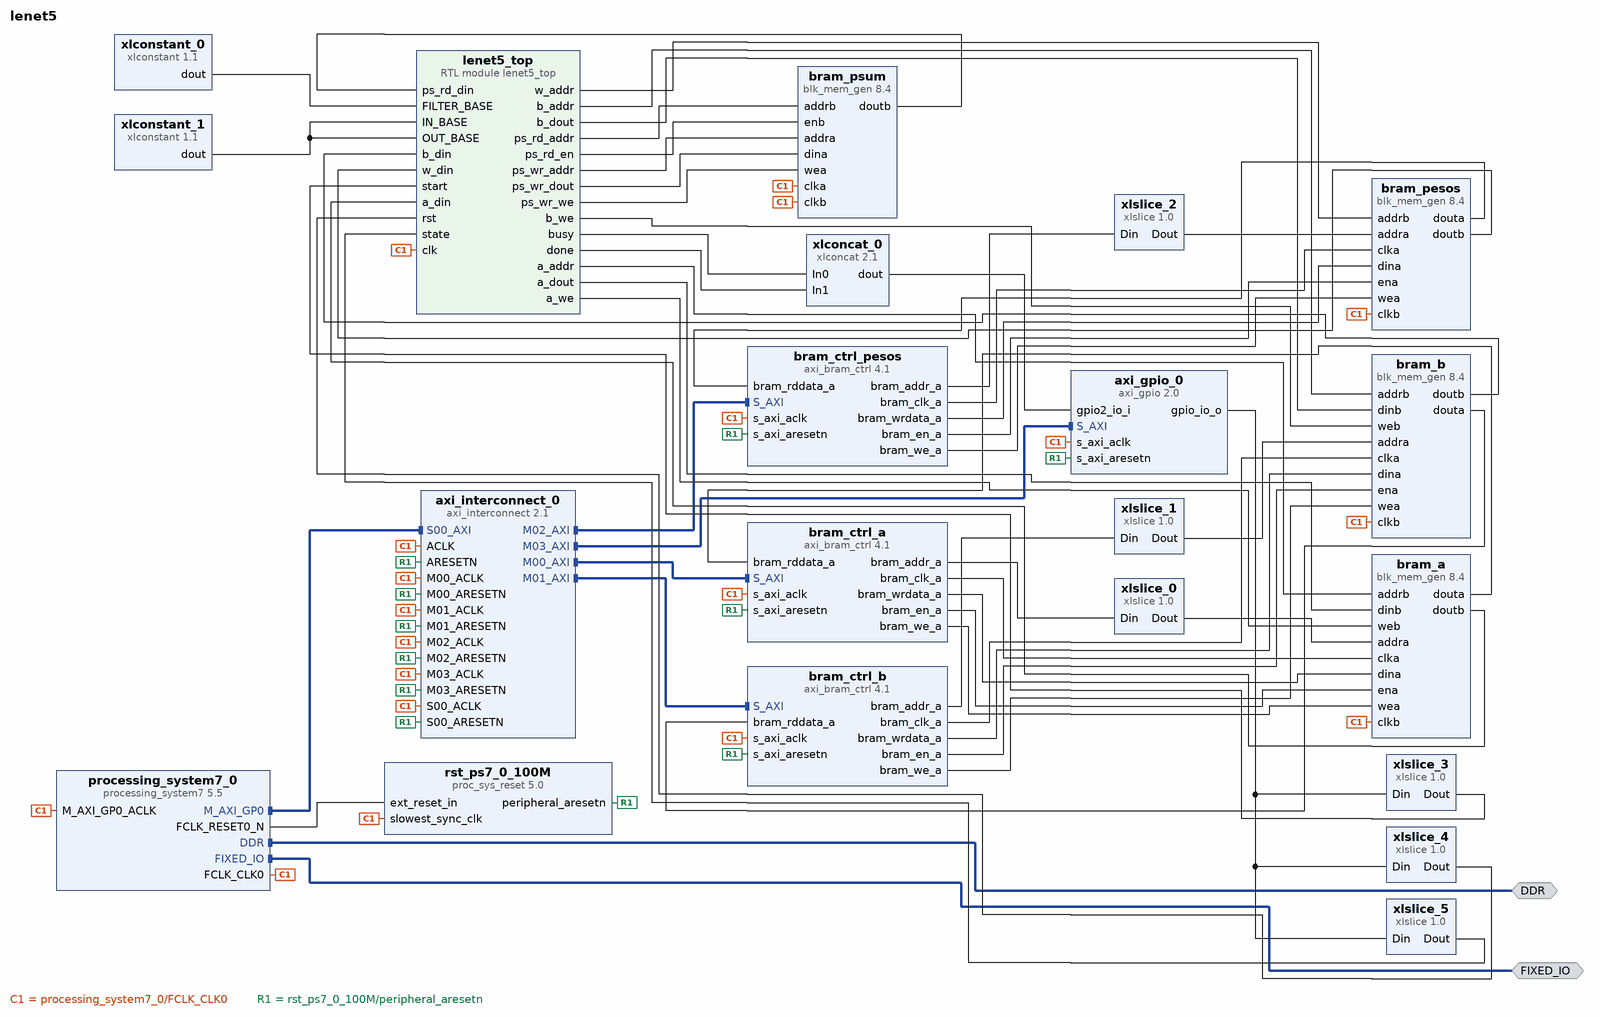
[diagram p0: block diagram of the top level]
# Vivado block design lenet5, xc7z010clg400-2, Vivado 2019.1
create_bd_design lenet5

create_bd_intf_port -mode Master -vlnv xilinx.com:interface:ddrx_rtl:1.0 DDR
create_bd_intf_port -mode Master -vlnv xilinx.com:display_processing_system7:fixedio_rtl:1.0 FIXED_IO

create_bd_cell -type ip -vlnv xilinx.com:ip:processing_system7:5.5 processing_system7_0
set_property -dict [list \
  CONFIG.PCW_FPGA0_PERIPHERAL_FREQMHZ 100 \
  CONFIG.PCW_UART0_PERIPHERAL_ENABLE 1 \
  CONFIG.PCW_UART0_UART0_IO {MIO 10 .. 11} \
  CONFIG.PCW_UART_PERIPHERAL_FREQMHZ 100 \
] [get_bd_cells processing_system7_0]
# 41 more settings of processing_system7_0 are not shown: defaults, MIO pin electricals, DDR timing, and values the tool derives
create_bd_cell -type ip -vlnv xilinx.com:ip:blk_mem_gen:8.4 bram_a
set_property -dict [list \
  CONFIG.Byte_Size 8 \
  CONFIG.Enable_32bit_Address false \
  CONFIG.Enable_B Always_Enabled \
  CONFIG.Memory_Type True_Dual_Port_RAM \
  CONFIG.Port_B_Clock 100 \
  CONFIG.Port_B_Enable_Rate 100 \
  CONFIG.Port_B_Write_Rate 50 \
  CONFIG.Read_Width_A 128 \
  CONFIG.Read_Width_B 128 \
  CONFIG.Register_PortA_Output_of_Memory_Primitives true \
  CONFIG.Register_PortB_Output_of_Memory_Primitives true \
  CONFIG.Use_Byte_Write_Enable true \
  CONFIG.Use_RSTA_Pin false \
  CONFIG.Write_Depth_A 512 \
  CONFIG.Write_Width_A 128 \
  CONFIG.Write_Width_B 128 \
  CONFIG.use_bram_block Stand_Alone \
] [get_bd_cells bram_a]
create_bd_cell -type ip -vlnv xilinx.com:ip:blk_mem_gen:8.4 bram_b
set_property -dict [list \
  CONFIG.Byte_Size 8 \
  CONFIG.Enable_32bit_Address false \
  CONFIG.Enable_B Always_Enabled \
  CONFIG.Memory_Type True_Dual_Port_RAM \
  CONFIG.Port_B_Clock 100 \
  CONFIG.Port_B_Enable_Rate 100 \
  CONFIG.Port_B_Write_Rate 50 \
  CONFIG.Read_Width_A 128 \
  CONFIG.Read_Width_B 128 \
  CONFIG.Register_PortA_Output_of_Memory_Primitives true \
  CONFIG.Register_PortB_Output_of_Memory_Primitives true \
  CONFIG.Use_Byte_Write_Enable true \
  CONFIG.Use_RSTA_Pin false \
  CONFIG.Use_RSTB_Pin false \
  CONFIG.Write_Depth_A 512 \
  CONFIG.Write_Width_A 128 \
  CONFIG.Write_Width_B 128 \
  CONFIG.use_bram_block Stand_Alone \
] [get_bd_cells bram_b]
create_bd_cell -type ip -vlnv xilinx.com:ip:blk_mem_gen:8.4 bram_pesos
set_property -dict [list \
  CONFIG.Byte_Size 8 \
  CONFIG.Enable_32bit_Address false \
  CONFIG.Enable_B Always_Enabled \
  CONFIG.Memory_Type True_Dual_Port_RAM \
  CONFIG.Port_B_Clock 100 \
  CONFIG.Port_B_Enable_Rate 100 \
  CONFIG.Port_B_Write_Rate 50 \
  CONFIG.Read_Width_A 128 \
  CONFIG.Read_Width_B 128 \
  CONFIG.Register_PortA_Output_of_Memory_Primitives true \
  CONFIG.Register_PortB_Output_of_Memory_Primitives true \
  CONFIG.Use_Byte_Write_Enable true \
  CONFIG.Use_RSTA_Pin false \
  CONFIG.Write_Depth_A 8192 \
  CONFIG.Write_Width_A 128 \
  CONFIG.Write_Width_B 128 \
  CONFIG.use_bram_block Stand_Alone \
] [get_bd_cells bram_pesos]
create_bd_cell -type ip -vlnv xilinx.com:ip:blk_mem_gen:8.4 bram_psum
set_property -dict [list \
  CONFIG.Byte_Size 8 \
  CONFIG.Enable_32bit_Address false \
  CONFIG.Enable_A Always_Enabled \
  CONFIG.Enable_B Use_ENB_Pin \
  CONFIG.Memory_Type Simple_Dual_Port_RAM \
  CONFIG.Operating_Mode_A WRITE_FIRST \
  CONFIG.Port_B_Clock 100 \
  CONFIG.Port_B_Enable_Rate 100 \
  CONFIG.Read_Width_B 32 \
  CONFIG.Register_PortB_Output_of_Memory_Primitives true \
  CONFIG.Use_Byte_Write_Enable true \
  CONFIG.Write_Depth_A 2048 \
  CONFIG.Write_Width_A 32 \
  CONFIG.Write_Width_B 32 \
  CONFIG.use_bram_block Stand_Alone \
] [get_bd_cells bram_psum]
create_bd_cell -type ip -vlnv xilinx.com:ip:axi_bram_ctrl:4.1 bram_ctrl_a
set_property -dict {CONFIG.DATA_WIDTH 128 CONFIG.SINGLE_PORT_BRAM 1} [get_bd_cells bram_ctrl_a]
create_bd_cell -type ip -vlnv xilinx.com:ip:axi_bram_ctrl:4.1 bram_ctrl_b
set_property -dict {CONFIG.DATA_WIDTH 128 CONFIG.SINGLE_PORT_BRAM 1} [get_bd_cells bram_ctrl_b]
create_bd_cell -type ip -vlnv xilinx.com:ip:axi_bram_ctrl:4.1 bram_ctrl_pesos
set_property -dict {CONFIG.DATA_WIDTH 128 CONFIG.SINGLE_PORT_BRAM 1} [get_bd_cells bram_ctrl_pesos]
create_bd_cell -type ip -vlnv xilinx.com:ip:axi_gpio:2.0 axi_gpio_0
set_property -dict [list \
  CONFIG.C_ALL_INPUTS_2 1 \
  CONFIG.C_ALL_OUTPUTS 1 \
  CONFIG.C_GPIO2_WIDTH 2 \
  CONFIG.C_GPIO_WIDTH 5 \
  CONFIG.C_IS_DUAL 1 \
] [get_bd_cells axi_gpio_0]
create_bd_cell -type ip -vlnv xilinx.com:ip:xlslice:1.0 xlslice_0
set_property -dict {CONFIG.DIN_FROM 12 CONFIG.DIN_TO 4 CONFIG.DIN_WIDTH 13 CONFIG.DOUT_WIDTH 9} [get_bd_cells xlslice_0]
create_bd_cell -type ip -vlnv xilinx.com:ip:xlslice:1.0 xlslice_1
set_property -dict {CONFIG.DIN_FROM 12 CONFIG.DIN_TO 4 CONFIG.DIN_WIDTH 13 CONFIG.DOUT_WIDTH 9} [get_bd_cells xlslice_1]
create_bd_cell -type ip -vlnv xilinx.com:ip:xlconcat:2.1 xlconcat_0
create_bd_cell -type ip -vlnv xilinx.com:ip:xlslice:1.0 xlslice_3
set_property -dict {CONFIG.DIN_FROM 0 CONFIG.DIN_TO 0 CONFIG.DIN_WIDTH 5} [get_bd_cells xlslice_3]
create_bd_cell -type ip -vlnv xilinx.com:ip:xlslice:1.0 xlslice_4
set_property -dict {CONFIG.DIN_FROM 1 CONFIG.DIN_TO 1 CONFIG.DIN_WIDTH 5 CONFIG.DOUT_WIDTH 1} [get_bd_cells xlslice_4]
create_bd_cell -type ip -vlnv xilinx.com:ip:proc_sys_reset:5.0 rst_ps7_0_100M
create_bd_cell -type ip -vlnv xilinx.com:ip:axi_interconnect:2.1 axi_interconnect_0
set_property -dict {CONFIG.NUM_MI 4 CONFIG.STRATEGY 1} [get_bd_cells axi_interconnect_0]
create_bd_cell -type ip -vlnv xilinx.com:ip:xlconstant:1.1 xlconstant_1
set_property -dict {CONFIG.CONST_VAL 0 CONFIG.CONST_WIDTH 9} [get_bd_cells xlconstant_1]
create_bd_cell -type ip -vlnv xilinx.com:ip:xlslice:1.0 xlslice_5
set_property -dict {CONFIG.DIN_FROM 4 CONFIG.DIN_TO 2 CONFIG.DIN_WIDTH 5 CONFIG.DOUT_WIDTH 1} [get_bd_cells xlslice_5]
create_bd_cell -type ip -vlnv xilinx.com:ip:xlconstant:1.1 xlconstant_0
set_property -dict {CONFIG.CONST_VAL 0 CONFIG.CONST_WIDTH 13} [get_bd_cells xlconstant_0]
create_bd_cell -type ip -vlnv xilinx.com:ip:xlslice:1.0 xlslice_2
set_property -dict {CONFIG.DIN_FROM 16 CONFIG.DIN_TO 4 CONFIG.DIN_WIDTH 17 CONFIG.DOUT_WIDTH 12} [get_bd_cells xlslice_2]
create_bd_cell -type module -reference lenet5_top lenet5_top

# ---- connections ----

connect_bd_intf_net [get_bd_intf_ports DDR] [get_bd_intf_pins processing_system7_0/DDR]
connect_bd_intf_net [get_bd_intf_pins axi_interconnect_0/M03_AXI] [get_bd_intf_pins axi_gpio_0/S_AXI]
connect_bd_intf_net [get_bd_intf_pins processing_system7_0/M_AXI_GP0] [get_bd_intf_pins axi_interconnect_0/S00_AXI]
connect_bd_intf_net [get_bd_intf_pins axi_interconnect_0/M02_AXI] [get_bd_intf_pins bram_ctrl_pesos/S_AXI]
connect_bd_intf_net [get_bd_intf_ports FIXED_IO] [get_bd_intf_pins processing_system7_0/FIXED_IO]
connect_bd_intf_net [get_bd_intf_pins axi_interconnect_0/M01_AXI] [get_bd_intf_pins bram_ctrl_b/S_AXI]
connect_bd_intf_net [get_bd_intf_pins axi_interconnect_0/M00_AXI] [get_bd_intf_pins bram_ctrl_a/S_AXI]
connect_bd_net [get_bd_pins bram_ctrl_a/bram_clk_a] [get_bd_pins bram_a/clka]
connect_bd_net [get_bd_pins bram_ctrl_a/bram_wrdata_a] [get_bd_pins bram_a/dina]
connect_bd_net [get_bd_pins bram_a/douta] [get_bd_pins bram_ctrl_a/bram_rddata_a]
connect_bd_net [get_bd_pins bram_ctrl_a/bram_en_a] [get_bd_pins bram_a/ena]
connect_bd_net [get_bd_pins bram_ctrl_a/bram_we_a] [get_bd_pins bram_a/wea]
connect_bd_net [get_bd_pins bram_ctrl_b/bram_clk_a] [get_bd_pins bram_b/clka]
connect_bd_net [get_bd_pins bram_ctrl_b/bram_wrdata_a] [get_bd_pins bram_b/dina]
connect_bd_net [get_bd_pins bram_b/douta] [get_bd_pins bram_ctrl_b/bram_rddata_a]
connect_bd_net [get_bd_pins bram_ctrl_b/bram_en_a] [get_bd_pins bram_b/ena]
connect_bd_net [get_bd_pins bram_ctrl_b/bram_we_a] [get_bd_pins bram_b/wea]
connect_bd_net [get_bd_pins bram_ctrl_pesos/bram_clk_a] [get_bd_pins bram_pesos/clka]
connect_bd_net [get_bd_pins bram_ctrl_pesos/bram_wrdata_a] [get_bd_pins bram_pesos/dina]
connect_bd_net [get_bd_pins bram_pesos/douta] [get_bd_pins bram_ctrl_pesos/bram_rddata_a]
connect_bd_net [get_bd_pins bram_ctrl_pesos/bram_en_a] [get_bd_pins bram_pesos/ena]
connect_bd_net [get_bd_pins bram_ctrl_pesos/bram_we_a] [get_bd_pins bram_pesos/wea]
connect_bd_net [get_bd_pins bram_ctrl_a/bram_addr_a] [get_bd_pins xlslice_0/Din]
connect_bd_net [get_bd_pins xlslice_0/Dout] [get_bd_pins bram_a/addra]
connect_bd_net [get_bd_pins bram_ctrl_b/bram_addr_a] [get_bd_pins xlslice_1/Din]
connect_bd_net [get_bd_pins xlslice_1/Dout] [get_bd_pins bram_b/addra]
connect_bd_net [get_bd_pins lenet5_top/ps_rd_addr] [get_bd_pins bram_psum/addrb]
connect_bd_net [get_bd_pins bram_psum/doutb] [get_bd_pins lenet5_top/ps_rd_din]
connect_bd_net [get_bd_pins lenet5_top/ps_rd_en] [get_bd_pins bram_psum/enb]
connect_bd_net [get_bd_pins lenet5_top/ps_wr_addr] [get_bd_pins bram_psum/addra]
connect_bd_net -net lenet5_top_ps_wr_din [get_bd_pins lenet5_top/ps_wr_dout] [get_bd_pins bram_psum/dina]
connect_bd_net [get_bd_pins lenet5_top/ps_wr_we] [get_bd_pins bram_psum/wea]
connect_bd_net [get_bd_pins lenet5_top/busy] [get_bd_pins xlconcat_0/In0]
connect_bd_net [get_bd_pins lenet5_top/done] [get_bd_pins xlconcat_0/In1]
connect_bd_net [get_bd_pins xlconcat_0/dout] [get_bd_pins axi_gpio_0/gpio2_io_i]
connect_bd_net [get_bd_pins xlslice_3/Dout] [get_bd_pins lenet5_top/start]
connect_bd_net [get_bd_pins xlslice_4/Dout] [get_bd_pins lenet5_top/rst]
connect_bd_net [get_bd_pins processing_system7_0/FCLK_CLK0] \
  [get_bd_pins processing_system7_0/M_AXI_GP0_ACLK] [get_bd_pins bram_ctrl_a/s_axi_aclk] \
  [get_bd_pins rst_ps7_0_100M/slowest_sync_clk] [get_bd_pins bram_ctrl_b/s_axi_aclk] [get_bd_pins bram_ctrl_pesos/s_axi_aclk] \
  [get_bd_pins axi_gpio_0/s_axi_aclk] [get_bd_pins bram_b/clkb] [get_bd_pins bram_a/clkb] [get_bd_pins bram_psum/clkb] \
  [get_bd_pins bram_pesos/clkb] [get_bd_pins axi_interconnect_0/ACLK] [get_bd_pins axi_interconnect_0/S00_ACLK] \
  [get_bd_pins axi_interconnect_0/M00_ACLK] [get_bd_pins axi_interconnect_0/M01_ACLK] \
  [get_bd_pins axi_interconnect_0/M02_ACLK] [get_bd_pins axi_interconnect_0/M03_ACLK] [get_bd_pins bram_psum/clka] \
  [get_bd_pins lenet5_top/clk]
connect_bd_net [get_bd_pins processing_system7_0/FCLK_RESET0_N] [get_bd_pins rst_ps7_0_100M/ext_reset_in]
connect_bd_net [get_bd_pins rst_ps7_0_100M/peripheral_aresetn] \
  [get_bd_pins bram_ctrl_a/s_axi_aresetn] [get_bd_pins bram_ctrl_b/s_axi_aresetn] [get_bd_pins bram_ctrl_pesos/s_axi_aresetn] \
  [get_bd_pins axi_gpio_0/s_axi_aresetn] [get_bd_pins axi_interconnect_0/S00_ARESETN] \
  [get_bd_pins axi_interconnect_0/M00_ARESETN] [get_bd_pins axi_interconnect_0/ARESETN] \
  [get_bd_pins axi_interconnect_0/M01_ARESETN] [get_bd_pins axi_interconnect_0/M02_ARESETN] \
  [get_bd_pins axi_interconnect_0/M03_ARESETN]
connect_bd_net [get_bd_pins lenet5_top/w_addr] [get_bd_pins bram_pesos/addrb]
connect_bd_net [get_bd_pins lenet5_top/b_addr] [get_bd_pins bram_b/addrb]
connect_bd_net [get_bd_pins lenet5_top/b_dout] [get_bd_pins bram_b/dinb]
connect_bd_net [get_bd_pins bram_b/doutb] [get_bd_pins lenet5_top/b_din]
connect_bd_net [get_bd_pins lenet5_top/b_we] [get_bd_pins bram_b/web]
connect_bd_net [get_bd_pins lenet5_top/a_addr] [get_bd_pins bram_a/addrb]
connect_bd_net [get_bd_pins lenet5_top/a_dout] [get_bd_pins bram_a/dinb]
connect_bd_net [get_bd_pins bram_a/doutb] [get_bd_pins lenet5_top/a_din]
connect_bd_net [get_bd_pins lenet5_top/a_we] [get_bd_pins bram_a/web]
connect_bd_net [get_bd_pins bram_pesos/doutb] [get_bd_pins lenet5_top/w_din]
connect_bd_net [get_bd_pins axi_gpio_0/gpio_io_o] [get_bd_pins xlslice_3/Din] [get_bd_pins xlslice_4/Din] [get_bd_pins xlslice_5/Din]
connect_bd_net [get_bd_pins xlslice_5/Dout] [get_bd_pins lenet5_top/state]
connect_bd_net [get_bd_pins xlconstant_0/dout] [get_bd_pins lenet5_top/FILTER_BASE]
connect_bd_net [get_bd_pins xlconstant_1/dout] [get_bd_pins lenet5_top/IN_BASE] [get_bd_pins lenet5_top/OUT_BASE]
connect_bd_net [get_bd_pins bram_ctrl_pesos/bram_addr_a] [get_bd_pins xlslice_2/Din]
connect_bd_net [get_bd_pins xlslice_2/Dout] [get_bd_pins bram_pesos/addra]

# ---- address map ----
assign_bd_address -offset 0x40000000 -range 8K -target_address_space [get_bd_addr_spaces processing_system7_0/Data] [get_bd_addr_segs bram_ctrl_a/S_AXI/Mem0]
assign_bd_address -offset 0x41200000 -range 4K -target_address_space [get_bd_addr_spaces processing_system7_0/Data] [get_bd_addr_segs axi_gpio_0/S_AXI/Reg]
assign_bd_address -offset 0x42000000 -range 8K -target_address_space [get_bd_addr_spaces processing_system7_0/Data] [get_bd_addr_segs bram_ctrl_b/S_AXI/Mem0]
assign_bd_address -offset 0x44000000 -range 128K -target_address_space [get_bd_addr_spaces processing_system7_0/Data] [get_bd_addr_segs bram_ctrl_pesos/S_AXI/Mem0]

validate_bd_design
save_bd_design
